# EAGLE design arietta-shield (EAGLE 6.5.0)
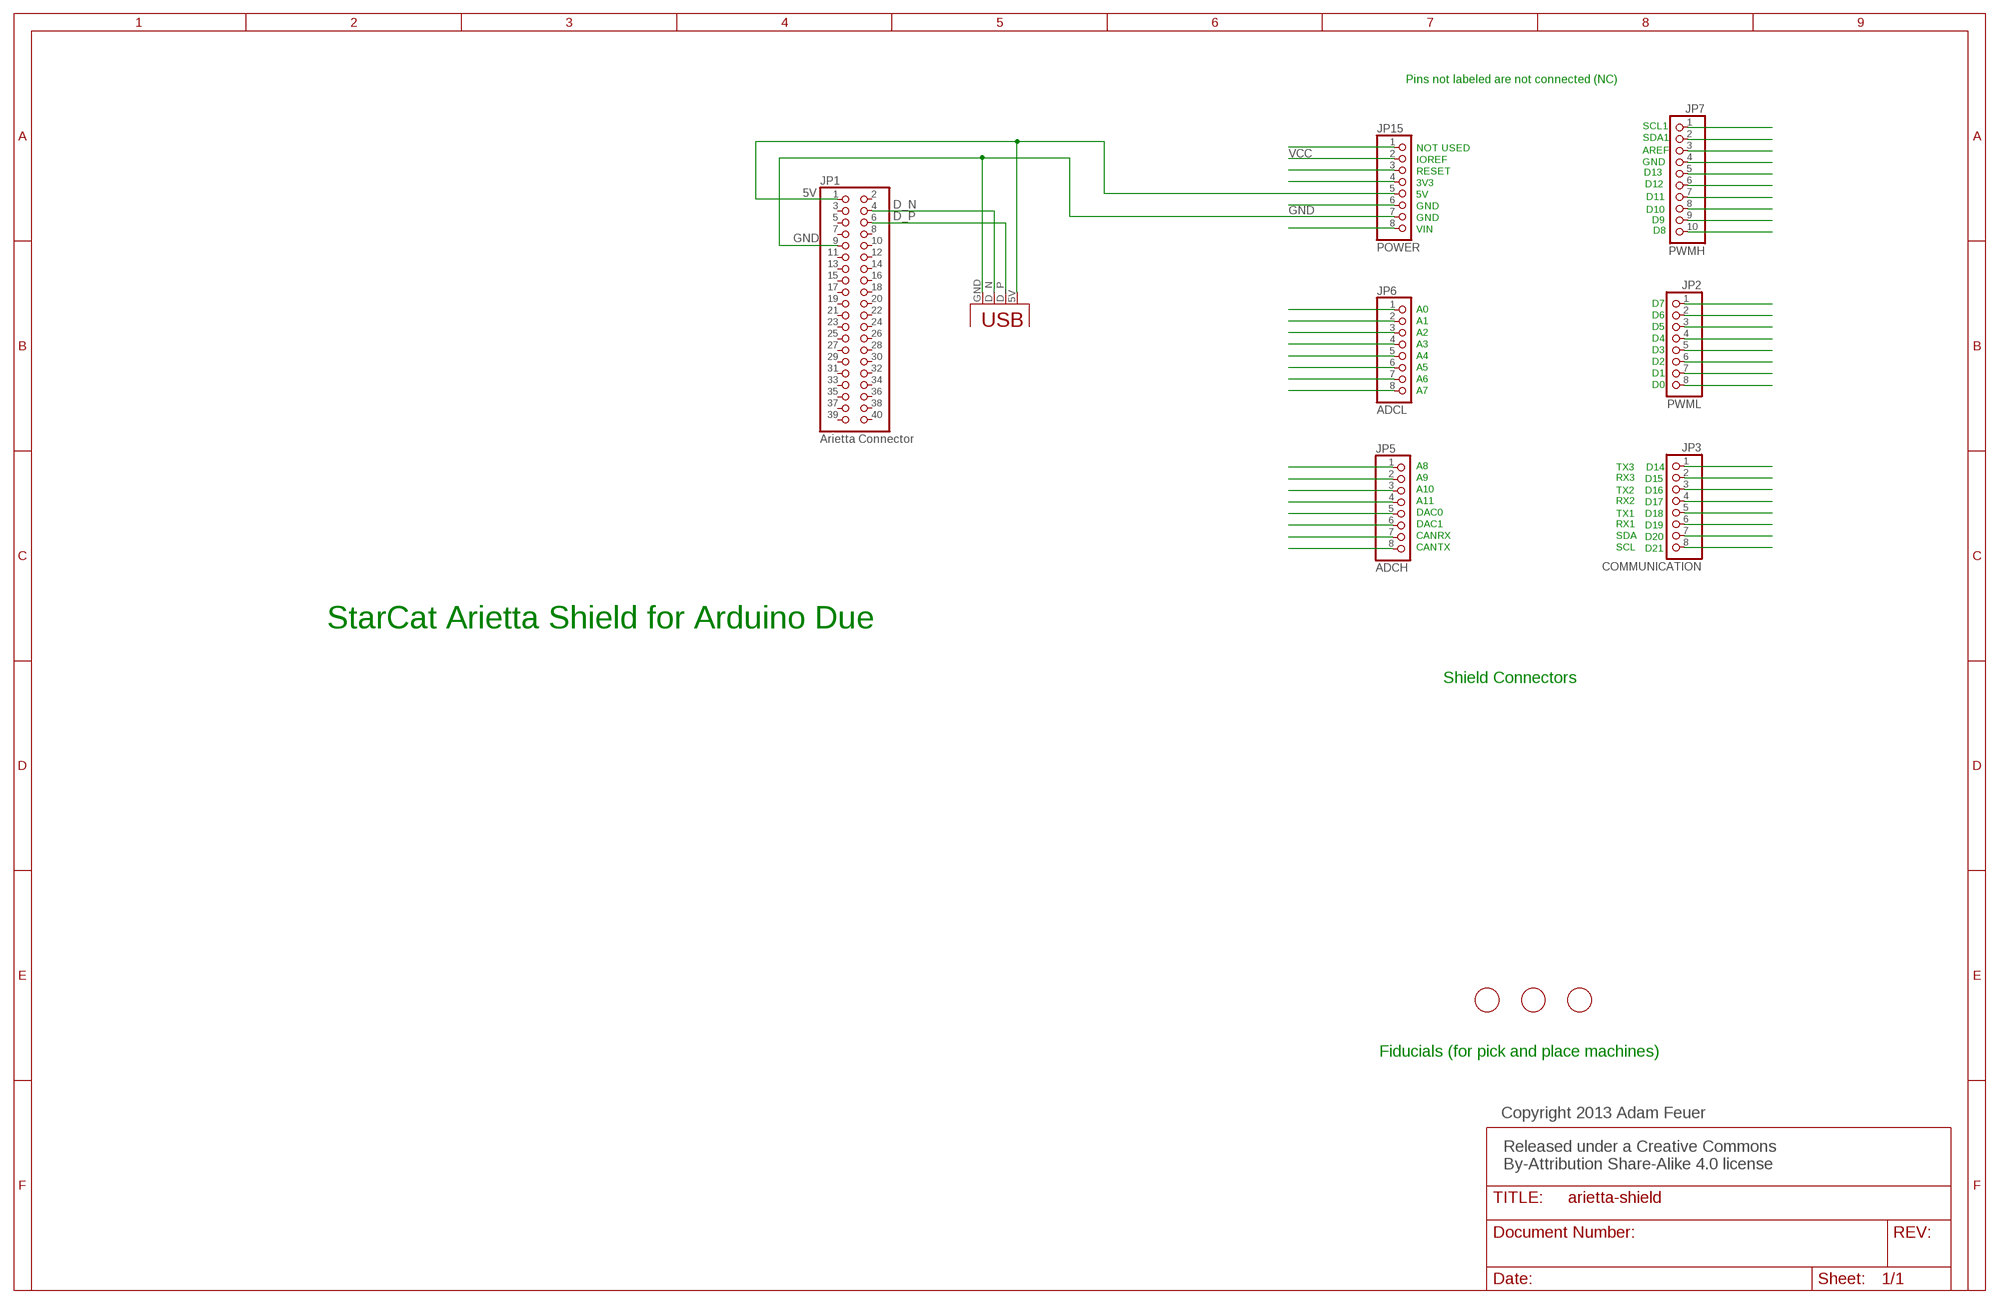
[diagram p0: schematic, sheet 1]

## Parts
JP1  Arietta Connector  PINHD-2X20  [2X20]
JP2  PWML  PINHD-1X8  [1X08]
JP3  COMMUNICATION  PINHD-1X8  [1X08]
JP5  ADCH  PINHD-1X8  [1X08]
JP6  ADCL  PINHD-1X8  [1X08]
JP7  PWMH  PINHD-1X10  [1X10]
JP15  POWER  PINHD-1X8  [1X08]
U$2  FIDUCIAL  [FIDUCIAL_1MM]
U$5  FIDUCIAL  [FIDUCIAL_1MM]
U$6  FIDUCIAL  [FIDUCIAL_1MM]
U$7  USB-A-FEMALE  [USB-A-FEMALE]

## Nets
5V [5V]: JP1.1 JP15.5 U$7.5V
D_N: JP1.4 U$7.D_N
D_P: JP1.6 U$7.D_P
GND [GND]: JP1.9 JP15.7 U$7.GND
N$1: JP7.9
N$2: JP5.1
N$3: JP15.1
N$4: JP3.7
N$5: JP2.7
N$7: JP7.3
N$8: JP7.4
N$9: JP7.5
N$10: JP7.6
N$11: JP7.7
N$12: JP7.10
N$13: JP2.1
N$14: JP2.2
N$15: JP2.3
N$16: JP2.5
N$17: JP2.6
N$18: JP2.8
N$19: JP3.1
N$22: JP3.2
N$25: JP3.5
N$26: JP3.6
N$32: JP3.8
N$37: JP5.8
N$43: JP5.7
N$44: JP5.6
N$55: JP5.5
N$56: JP5.4
N$57: JP5.3
N$58: JP5.2
N$65: JP6.4
N$66: JP6.3
N$68: JP6.2
N$69: JP15.8
N$71: JP15.6
N$72: JP15.3
N$110: JP6.6
N$112: JP6.7
N$569: JP6.8
N$571: JP15.4
N$572: JP6.1
N$573: JP6.5
N$574: JP7.1
N$575: JP7.2
N$576: JP7.8
N$577: JP2.4
N$578: JP3.3
N$579: JP3.4
VCC: JP15.2
Unconnected: JP1.2 JP1.3 JP1.5 JP1.7 JP1.8 JP1.10 JP1.11 JP1.12 JP1.13 JP1.14 JP1.15 JP1.16 JP1.17 JP1.18 JP1.19 JP1.20 JP1.21 JP1.22 JP1.23 JP1.24 JP1.25 JP1.26 JP1.27 JP1.28 JP1.29 JP1.30 JP1.31 JP1.32 JP1.33 JP1.34 JP1.35 JP1.36 JP1.37 JP1.38 JP1.39 JP1.40

## Notes on the sheet
- Pins not labeled are not connected (NC)
- SCL1
- SDA1
- NOT USED | AREF
- IOREF | GND
- RESET | D13
- 3V3 | D12
- 5V | D11
- GND
- D10
- GND | D9
- VIN | D8
- D7
- A0
- D6
- A1
- D5
- A2
- D4
- A3
- D3
- A4
- D2
- A5
- D1
- A6
- D0
- A7
- A8 | TX3 | D14
- A9 | RX3 | D15
- A10 | TX2 | D16
- A11 | RX2 | D17
- DAC0 | TX1 | D18
- DAC1 | RX1 | D19
- CANRX | SDA | D20
- CANTX | SCL | D21
- StarCat Arietta Shield for Arduino Due
- Shield Connectors
- Fiducials (for pick and place machines)
- Copyright 2013 Adam Feuer
- Released under a Creative Commons 
  By-Attribution Share-Alike 4.0 license

## Library data of the parts
JP1 = adafruit:PINHD-2X20: PIN HEADER
JP2 JP3 JP5 JP6 JP15 = SmartPrj:PINHD-1X8: PIN HEADER
JP7 = SmartPrj:PINHD-1X10: PIN HEADER
U$2 U$5 U$6 = adafruit:FIDUCIAL: For use by pick and place machines to calibrate the vision/machine, 1mm By microbuilder.eu
U$7 = te-conn-usb:USB-A-FEMALE: USB A Female connector - TE Connectivity PN 292303-1

## Net classes
0 USB_A: width 0.305 mm, drill 0.305 mm, clearance 0.508 mm
1 5V: width 0.305 mm, drill 0.305 mm, clearance 0.305 mm
2 GND: width 0.305 mm, drill 0.305 mm, clearance 0.305 mm

## Board
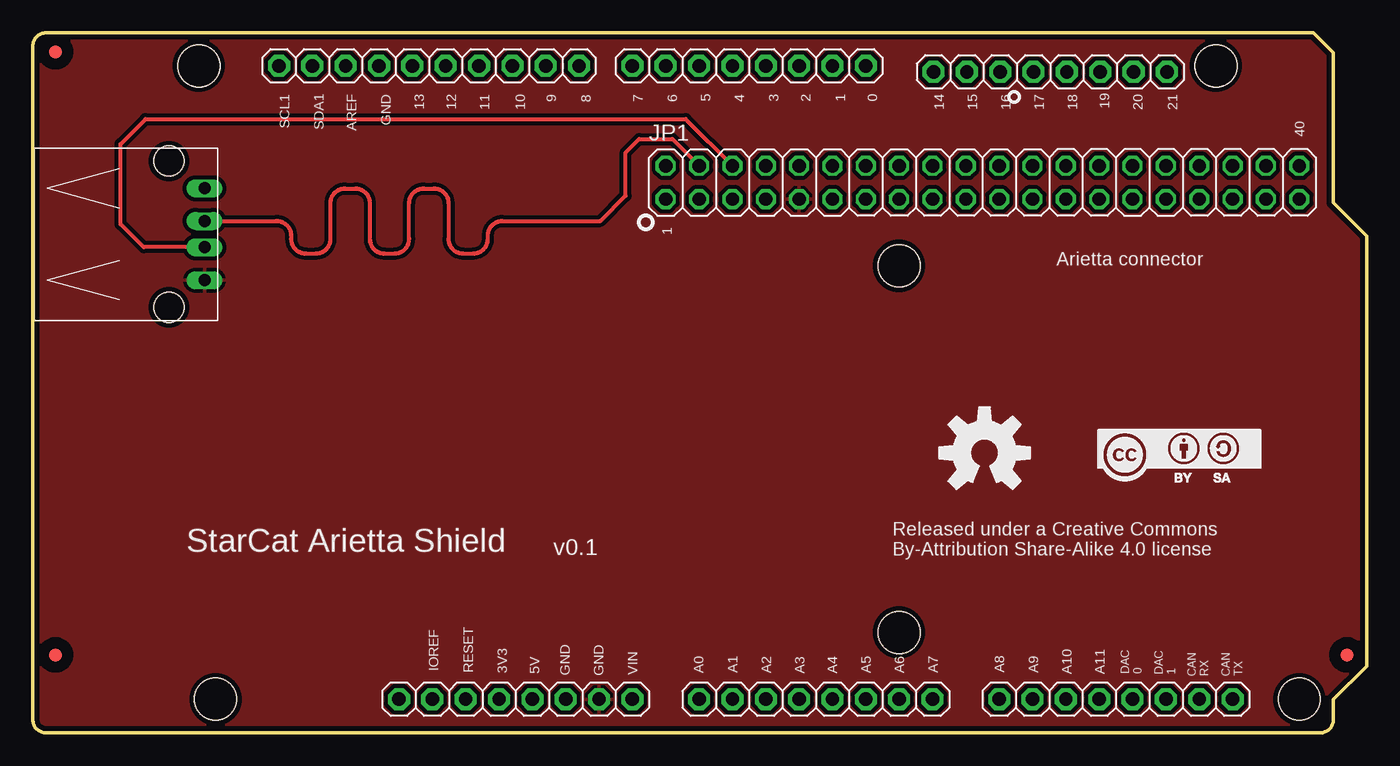
[diagram p1: board, top side]
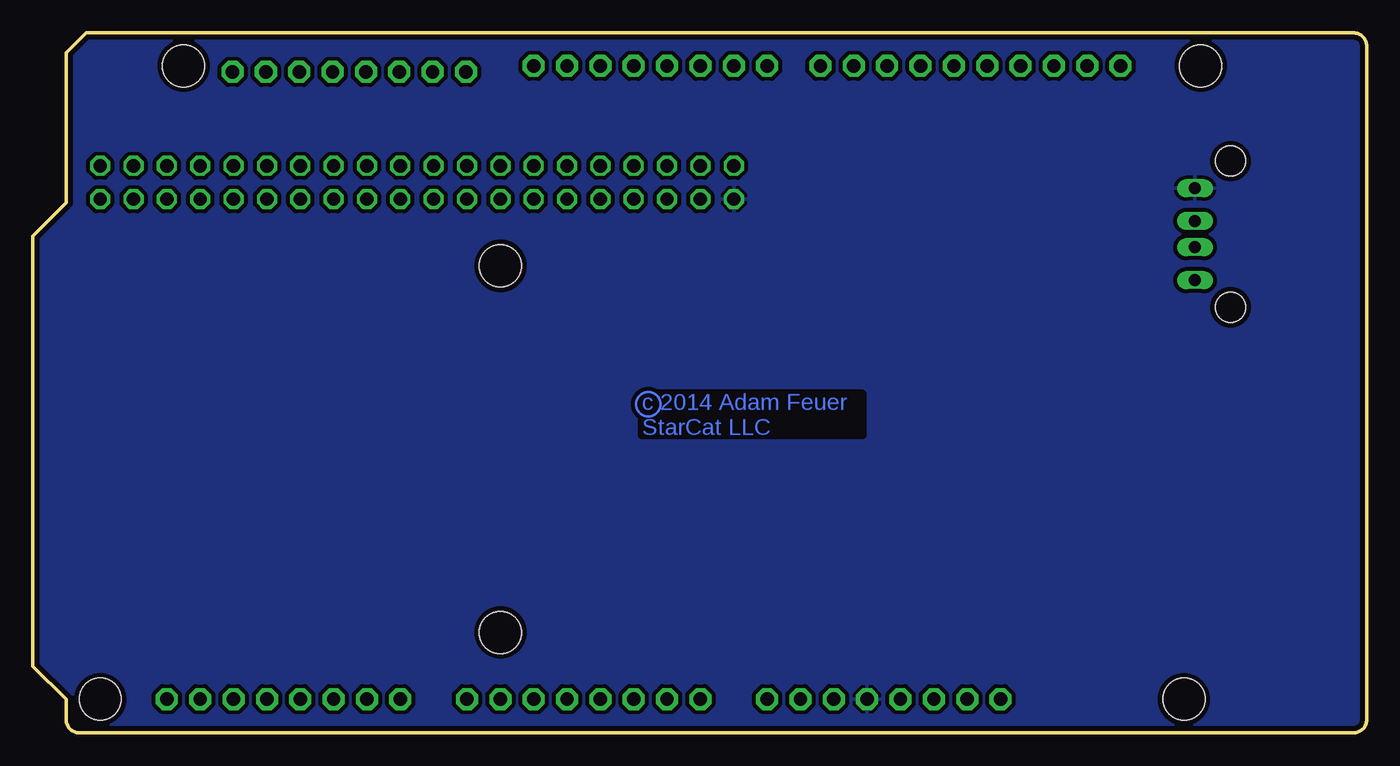
[diagram p2: board, bottom side, seen from below]

Size 101.6 x 53.34 mm. Coordinates in mm from the lower left corner, seen from the top.
Outline: 97.54,53.34 99.06,51.82 99.06,40.39 101.6,37.85 101.6,5.08 99.06,2.54 99.06,1 arc-90 98.06,0 1,0 arc-90 0,1 0,52.34 arc-90 1,53.34 97.54,53.34
Copper layers (1*16): Top 0.0356mm / dielectric 1.5011mm / Bottom 0.0356mm
Design rules "LaenPCBOrder": minimum track width 6mil, minimum drill 13mil, track to track 6mil, track to pad 6mil, pad to pad 6mil, via to via 6mil, smd to smd 6mil, copper to edge 15mil, drill to drill 6mil, minimum pad ring 7mil, minimum via ring 7mil, stop-mask expansion 3mil, vias tented up to drill 0mil, thermal gap 10mil
Holes 3.2 mm at 96.47,2.57 12.65,50.83 90.12,50.83 13.92,2.57 65.99,35.59 65.99,7.65

### Footprints (pad centres in the part's own frame; a part is rotated, then mirrored left to right if it is on the bottom)
2X20 = drill 1.016 octagon: 1 -24.13,-1.27; 2 -24.13,1.27; 3 -21.59,-1.27; 4 -21.59,1.27; 5 -19.05,-1.27; 6 -19.05,1.27; 7 -16.51,-1.27; 8 -16.51,1.27; 9 -13.97,-1.27; 10 -13.97,1.27; 11 -11.43,-1.27; 12 -11.43,1.27; 13 -8.89,-1.27; 14 -8.89,1.27; 15 -6.35,-1.27; 16 -6.35,1.27; 17 -3.81,-1.27; 18 -3.81,1.27; 19 -1.27,-1.27; 20 -1.27,1.27; 21 1.27,-1.27; 22 1.27,1.27; 23 3.81,-1.27; 24 3.81,1.27; 25 6.35,-1.27; 26 6.35,1.27; 27 8.89,-1.27; 28 8.89,1.27; 29 11.43,-1.27; 30 11.43,1.27; 31 13.97,-1.27; 32 13.97,1.27; 33 16.51,-1.27; 34 16.51,1.27; 35 19.05,-1.27; 36 19.05,1.27; 37 21.59,-1.27; 38 21.59,1.27; 39 24.13,-1.27; 40 24.13,1.27
1X08 = drill 1.016 pad 1.676 octagon: 1 -8.89,0; 2 -6.35,0; 3 -3.81,0; 4 -1.27,0; 5 1.27,0; 6 3.81,0; 7 6.35,0; 8 8.89,0
1X10 = drill 1.016 pad 1.676 octagon: 1 -11.43,0; 2 -8.89,0; 3 -6.35,0; 4 -3.81,0; 5 -1.27,0; 6 1.27,0; 7 3.81,0; 8 6.35,0; 9 8.89,0; 10 11.43,0
FIDUCIAL_1MM = smd 1 x 1: 1 0,0
USB-A-FEMALE = drill 0.92 long: 5V -3.5,0; D_N -1,0; D_P 1,0; GND 3.5,0 | hole 2.3: -5.57,-2.71; 5.57,-2.71

### Placement (x,y rotation side)
JP1  72.34,41.94 0 top
JP2  54.56,50.83 0 top
JP3  77.5,50.37 0 top
JP5  82.5,2.57 0 top
JP6  59.64,2.57 0 top
JP7  30.18,50.83 0 top
JP15  36.78,2.57 0 top
U$1  [OSHW-LOGO-L]  72.49,21.34 0 top
U$2  1.73,51.89 0 top
U$5  1.73,5.94 0 top
U$6  100.1,5.94 0 top
U$7  13.08,38 270 top
U$8  [CC-BY-SA]  80.98,18.82 0 top

### Tracks (layer width: path | path; a pad name or v marks a point on that pad's centre or on a via)
5V
  pour Bottom (rank 3): 1.19,0 97.54,0 arc90 99.09,0.94 99.06,2.54 101.57,5.16 101.6,37.82 99.06,40.39 99.06,51.79 97.28,53.37 1.12,53.34 arc90 -0.03,51.97 0,1.09 0.03,0.86 arc90
D_N
  Top 0.305: U$7.D_N 18.57,39 arc-90 19.68,37.89 19.68,37.63 arc90 20.78,36.52 21.57,36.52 arc90 22.67,37.63 22.67,40.37 arc-90 23.78,41.47 24.56,41.47 arc-90 25.67,40.37 25.67,37.63 arc90 26.77,36.52 27.56,36.52 arc90 28.67,37.63 28.67,40.37 arc-90 29.77,41.47 30.56,41.47 arc-90 31.66,40.37 31.66,37.63 arc90 32.77,36.52 33.55,36.52 arc90 34.66,37.63 34.66,37.89 arc-90 35.76,39 43.24,39 45.16,40.92 45.16,44.22 46.18,45.24 48.72,45.24 JP1.4
D_P
  Top 0.305: U$7.D_P 8.45,37 6.68,38.76 6.68,44.86 8.59,46.76 49.73,46.76 JP1.6
GND
  pour Top (isolate 0.305): 0.03,52.4 0.03,1.09 arc90 1.04,0.08 98.07,0.08 arc90 99.09,1.09 99.09,2.59 101.57,5.08 101.63,37.92 99.09,40.46 99.09,51.89 97.56,53.42 1.45,53.34 arc90
(copper drawn outside any net)
  shapes: Bottom circle x1

### Text on the board
Bottom: c 2014 Adam Feuer / StarCat LLC
tPlace: SCL1 | SDA1 | AREF | GND | 13 | 12 | 11 | 10 | 9 | 8 | 7 | 6 | 5 | 4 | 3 | 2 | 1 | 0 | 14 | 15 | 16 | 17 | 18 | 19 | 20 | 21 | 40 | 1 | Arietta connector | StarCat Arietta Shield | v0.1 | Released under a Creative Commons / By-Attribution Share-Alike 4.0 license | IOREF | RESET | 3V3 | A0 | A1 | A2 | A5 | A6 | A7 | A8 | A9 | 5V | GND | GND | VIN | A3 | A4 | A10 | A11 | DAC / 0 | DAC / 1 | CAN / RX | CAN / TX